# EAGLE design keypad (EAGLE 9.6.2)
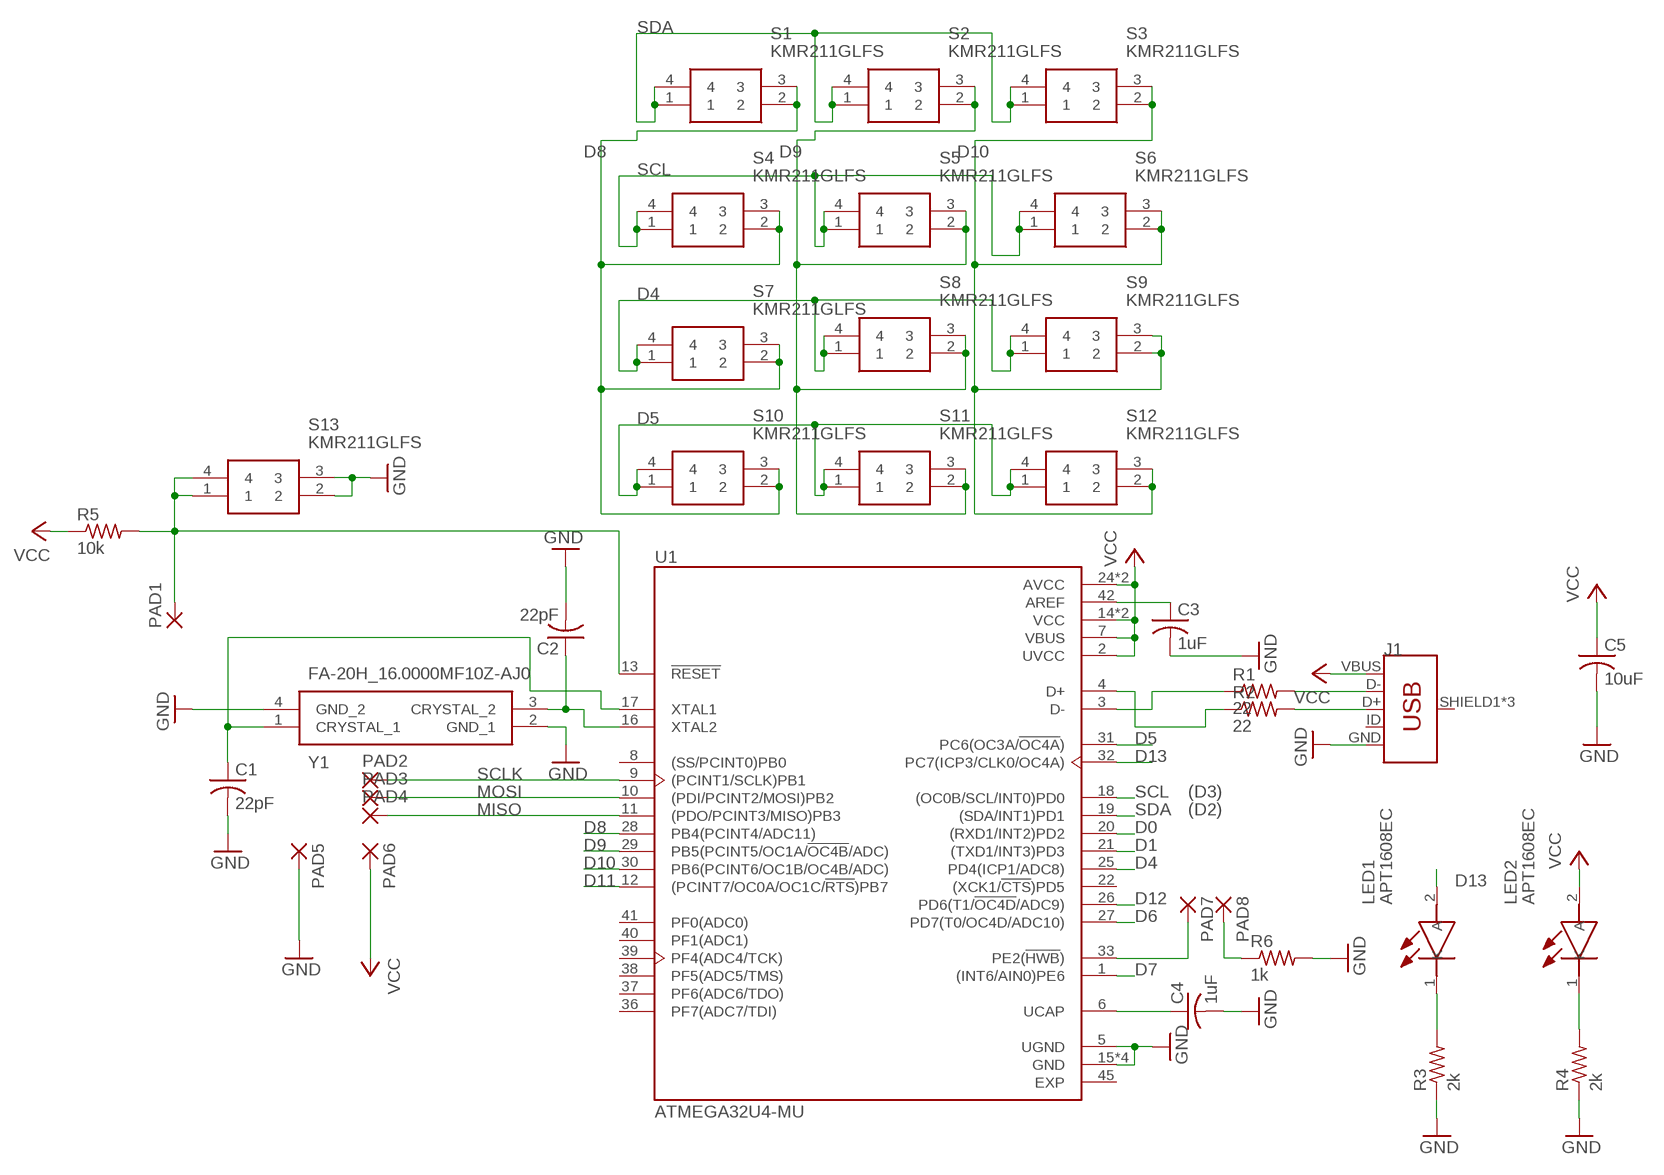
[diagram p0: schematic, sheet 1]

## Parts
C1  22pF  C-USC0603  [C0603]
C2  22pF  C-USC0603  [C0603]
C3  1uF  C-USC0603  [C0603]
C4  1uF  C-USC0603  [C0603]
C5  10uF  C-USC0603  [C0603]
J1  USB_MICRO-BREDUCED_PASTE  [USB-B-MICRO-SMD_RED_PASTE]
LED1  APT1608EC  [LEDC1608X85N]
LED2  APT1608EC  [LEDC1608X85N]
PAD1  SMD2  [SMD1,27-2,54]
PAD2  SMD2  [SMD1,27-2,54]
PAD3  SMD2  [SMD1,27-2,54]
PAD4  SMD2  [SMD1,27-2,54]
PAD5  SMD2  [SMD1,27-2,54]
PAD6  SMD2  [SMD1,27-2,54]
PAD7  SMD2  [SMD1,27-2,54]
PAD8  SMD2  [SMD1,27-2,54]
R1  22  R-US_R0603  [R0603]
R2  22  R-US_R0603  [R0603]
R3  2k  R-US_R0603  [R0603]
R4  2k  R-US_R0603  [R0603]
R5  10k  R-US_R0603  [R0603]
R6  1k  R-US_R0603  [R0603]
S1  KMR211GLFS  [KMR2_1]
S2  KMR211GLFS  [KMR2_1]
S3  KMR211GLFS  [KMR2_1]
S4  KMR211GLFS  [KMR2_1]
S5  KMR211GLFS  [KMR2_1]
S6  KMR211GLFS  [KMR2_1]
S7  KMR211GLFS  [KMR2_1]
S8  KMR211GLFS  [KMR2_1]
S9  KMR211GLFS  [KMR2_1]
S10  KMR211GLFS  [KMR2_1]
S11  KMR211GLFS  [KMR2_1]
S12  KMR211GLFS  [KMR2_1]
S13  KMR211GLFS  [KMR2_1]
U1  ATMEGA32U4-MU  [QFN50P700X700X100-45N]
Y1  FA-20H_16.0000MF10Z-AJ0  [FA20H160000MF12ZAC3]

## Nets
D0: U1.20((RXD1/INT2)PD2)
D1: U1.21((TXD1/INT3)PD3)
D4: S7.1 S7.4 S8.1 S8.4 S9.1 S9.4 U1.25(PD4(ICP1/ADC8))
D5: S10.1 S10.4 S11.1 S11.4 S12.1 S12.4 U1.31(PC6(OC3A/!OC4A!))
D6: U1.27(PD7(T0/OC4D/ADC10))
D7: U1.1((INT6/AIN0)PE6)
D8: S1.2 S1.3 S4.2 S4.3 S7.2 S7.3 S10.2 S10.3 U1.28(PB4(PCINT4/ADC11))
D9: S2.2 S2.3 S5.2 S5.3 S8.2 S8.3 S11.2 S11.3 U1.29(PB5(PCINT5/OC1A/!OC4B!/ADC))
D10: S3.2 S3.3 S6.2 S6.3 S9.2 S9.3 S12.2 S12.3 U1.30(PB6(PCINT6/OC1B/OC4B/ADC))
D11: U1.12((PCINT7/OC0A/OC1C/!RTS!)PB7)
D12: U1.26(PD6(T1/!OC4D!/ADC9))
D13: LED1.2(A) U1.32(PC7(ICP3/CLK0/OC4A))
GND: C1.2 C2.2 C3.2 C4.2 C5.2 J1.GND PAD5.1(P) R3.1 R4.1 R6.2 S13.2 S13.3 U1.5(UGND) U1.15(GND) U1.23(GND) U1.35(GND) U1.43(GND) Y1.2(GND_1) Y1.4(GND_2)
MISO: PAD4.1(P) U1.11((PDO/PCINT3/MISO)PB3)
MOSI: PAD3.1(P) U1.10((PDI/PCINT2/MOSI)PB2)
N$1: LED2.1(K) R4.2
N$2: PAD8.1(P) R6.1
N$3: PAD7.1(P) U1.33(PE2(!HWB!))
N$4: C2.1 U1.16(XTAL2) Y1.3(CRYSTAL_2)
N$7: C1.1 U1.17(XTAL1) Y1.1(CRYSTAL_1)
N$9: C3.1 U1.42(AREF)
N$10: C4.1 U1.6(UCAP)
N$12: J1.D- R1.2
N$13: J1.D+ R2.2
N$14: R1.1 U1.3(D-)
N$15: R2.1 U1.4(D+)
N$16: PAD1.1(P) R5.2 S13.1 S13.4 U1.13(!RESET!)
N$20: LED1.1(K) R3.2
SCL: S4.1 S4.4 S5.1 S5.4 S6.1 S6.4 U1.18((OC0B/SCL/INT0)PD0)
SCLK: PAD2.1(P) U1.9((PCINT1/SCLK)PB1)
SDA: S1.1 S1.4 S2.1 S2.4 S3.1 S3.4 U1.19((SDA/INT1)PD1)
VCC: C5.1 J1.VBUS LED2.2(A) PAD6.1(P) R5.1 U1.2(UVCC) U1.7(VBUS) U1.14(VCC) U1.24(AVCC) U1.34(VCC) U1.44(AVCC)
Unconnected: J1.ID J1.SHIELD1(SHIELD) J1.SHIELD2(SHIELD) J1.SHIELD3(SHIELD) U1.8((SS/PCINT0)PB0) U1.22((XCK1/!CTS!)PD5) U1.36(PF7(ADC7/TDI)) U1.37(PF6(ADC6/TDO)) U1.38(PF5(ADC5/TMS)) U1.39(PF4(ADC4/TCK)) U1.40(PF1(ADC1)) U1.41(PF0(ADC0)) U1.45(EXP)

## Notes on the sheet
- (D3)
- (D2)

## Library data of the parts
C1-C5 = adafruit:C-US: CAPACITOR, American symbol
J1 = SparkFun-Connectors:USB_MICRO-B: USB Type Micro-B Connector Male/female and PTH/SMT variants SparkFun Products: SparkFun microB USB Breakout <https://www.sparkfun.com/products/12035> SparkFun USB microB Plug Breakout <https://www.sparkfun.com/products/10031> SparkFun ESP8266 Thing <https://www.sparkfun.com/products/13231>; PROD_ID: CONN-11752
LED1 LED2 = APT1608EC:APT1608EC: Standard LEDs - SMD HI EFF RED WTR CLR Source: Datasheet <http://docs-emea.rs-online.com/webdocs/142e/0900766b8142ead4.pdf>; ARROW_PART_NUMBER: APT1608EC; ARROW_PRICE-STOCK: https://www.arrow.com/en/products/apt1608ec/kingbright; DESCRIPTION: Standard LEDs - SMD HI EFF RED WTR CLR; HEIGHT: 0.85mm; MANUFACTURER_NAME: Kingbright; MANUFACTURER_PART_NUMBER: APT1608EC; MOUSER_PART_NUMBER: 604-APT1608EC; MOUSER_PRICE-STOCK: https://www.mouser.co.uk/ProductDetail/Kingbright/APT1608EC?qs=y3UkhjaxUTbvcINjaB1ATQ%3D%3D
PAD1-PAD8 = wirepad:SMD2: SMD PAD
R1-R6 = adafruit:R-US_: RESISTOR, American symbol
S1-S13 = KMR211GLFS:KMR211GLFS: KMR211GLFS (Tactile Switches) Source: Datasheet <https://www.ckswitches.com/media/1479/kmr2.pdf>; DESCRIPTION: KMR211GLFS (Tactile Switches); HEIGHT: mm; MANUFACTURER_NAME: C & K COMPONENTS; MANUFACTURER_PART_NUMBER: KMR211GLFS; MOUSER_PART_NUMBER: 611-KMR211G-LFS; MOUSER_PRICE-STOCK: https://www.mouser.co.uk/ProductDetail/CK/KMR211GLFS?qs=sb%252But3Lm4x2P2O4tos22XA%3D%3D
U1 = ATMEGA32U4-MU:ATMEGA32U4-MU: 8-bit Microcontrollers - MCU AVR USB 32K FLASH INDUSTRIA Check prices <https://pricing.snapeda.com/search/part/ATMEGA32U4-MU/?ref=eda>; AVAILABILITY: Good; DESCRIPTION: AVR AVR® ATmega Microcontroller IC 8-Bit 16MHz 32KB (16K x 16) FLASH 44-VQFN (7x7); MF: Microchip Technology / Atmel; MP: ATMEGA32U4-MU; PACKAGE: VFQFN-44 Microchip Technology / Atmel; PRICE: None; PURCHASE-URL: https://pricing.snapeda.com/search/part/ATMEGA32U4-MU/?ref=eda
Y1 = FA-20H_16.0000MF10Z-AJ0:FA-20H_16.0000MF10Z-AJ0: Source: Datasheet <https://support.epson.biz/td/api/doc_check.php?dl=brief_FA-20H&lang=en>; ARROW_PART_NUMBER: FA-20H 16.0000MF10Z-AJ0; ARROW_PRICE-STOCK: https://www.arrow.com/en/products/fa-20h16.0000mf10z-aj0/epson-electronics-america; HEIGHT: 0.55mm; MANUFACTURER_NAME: Epson Timing; MANUFACTURER_PART_NUMBER: FA-20H 16.0000MF10Z-AJ0; MOUSER_PART_NUMBER: 732-FA-20H16MF10ZAJ0; MOUSER_PRICE-STOCK: https://www.mouser.co.uk/ProductDetail/Epson-Timing/FA-20H-160000MF10Z-AJ0?qs=f9yNj16SXrIaU%252BY5GFRuIg%3D%3D

## Board
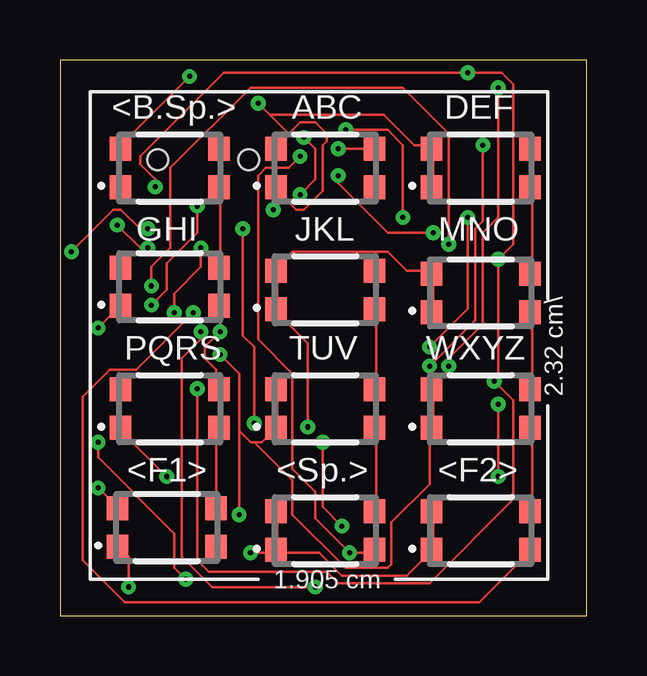
[diagram p1: board, top side]
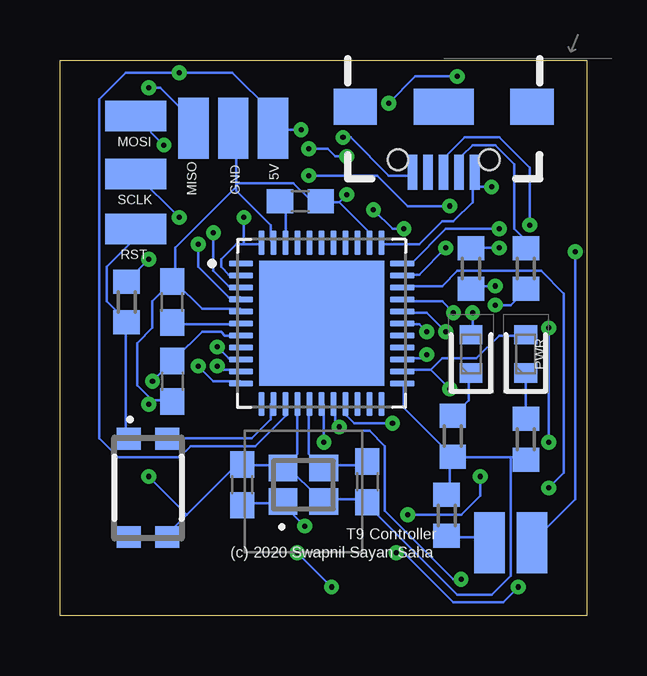
[diagram p2: board, bottom side, seen from below]

Size 21.95 x 23.16 mm. Coordinates in mm from the lower left corner, seen from the top.
Outline: 0,0 21.95,0 21.95,23.16 0,23.16 0,0
Copper layers (1*16): Top 0.035mm / dielectric 1.5mm / Bottom 0.035mm
Design rules "default *": minimum track width 4mil, minimum drill 0.21mm, track to track 5mil, track to pad 5mil, pad to pad 5mil, via to via 5mil, smd to smd 5mil, copper to edge 5mil, drill to drill 5mil, minimum pad ring 10mil, minimum via ring 8mil, stop-mask expansion 4mil, vias tented up to drill 20mil, thermal gap 10mil

### Footprints (pad centres in the part's own frame; a part is rotated, then mirrored left to right if it is on the bottom)
C0603 = smd 1.1 x 1: 1 -0.85,0; 2 0.85,0
USB-B-MICRO-SMD_RED_PASTE = smd 1.45 x 0.4: D+ 2.725,0; D- 2.725,0.65; GND 2.725,-1.3; ID 2.725,-0.65; VBUS 2.725,1.3 | smd 1.5 x 1.8: SHIELD1 0,3.685; SHIELD2 0,-3.685 | smd 1.5 x 2.5: SHIELD3 0,0 | hole 0.85: 2.2,1.9; 2.2,-1.9
LEDC1608X85N = smd 0.8 x 0.95: 1 -0.8,0; 2 0.8,0
SMD1,27-2,54 = smd 1.27 x 2.54: 1 0,0
R0603 = smd 1 x 1.1: 1 -0.85,0; 2 0.85,0
KMR2_1 = smd 0.9 x 1: 1 -2.05,-0.8; 2 2.05,-0.8; 3 2.05,0.8; 4 -2.05,0.8
QFN50P700X700X100-45N = smd 1.01 x 0.26: 1 -3.36,2.5; 2 -3.36,2; 3 -3.36,1.5; 4 -3.36,1; 5 -3.36,0.5; 6 -3.36,0; 7 -3.36,-0.5; 8 -3.36,-1; 9 -3.36,-1.5; 10 -3.36,-2; 11 -3.36,-2.5; 23 3.36,-2.5; 24 3.36,-2; 25 3.36,-1.5; 26 3.36,-1; 27 3.36,-0.5; 28 3.36,0; 29 3.36,0.5; 30 3.36,1; 31 3.36,1.5; 32 3.36,2; 33 3.36,2.5 | smd 0.26 x 1.01: 12 -2.5,-3.36; 13 -2,-3.36; 14 -1.5,-3.36; 15 -1,-3.36; 16 -0.5,-3.36; 17 0,-3.36; 18 0.5,-3.36; 19 1,-3.36; 20 1.5,-3.36; 21 2,-3.36; 22 2.5,-3.36; 34 2.5,3.36; 35 2,3.36; 36 1.5,3.36; 37 1,3.36; 38 0.5,3.36; 39 0,3.36; 40 -0.5,3.36; 41 -1,3.36; 42 -1.5,3.36; 43 -2,3.36; 44 -2.5,3.36 | smd 5.2 x 5.2: 45 0,0
FA20H160000MF12ZAC3 = smd 1.2 x 1.1: 1 -0.85,-0.7; 2 0.85,-0.7; 3 0.85,0.7; 4 -0.85,0.7

### Placement (x,y rotation side)
C1  14.35,5.46 90 bottom
C2  9.14,5.59 270 bottom
C3  11.94,17.27 0 bottom
C4  17.27,13.08 90 bottom
C5  17.27,9.78 270 bottom
J1  5.97,21.21 270 bottom
LED1  4.83,10.92 90 bottom
LED2  2.54,10.92 90 bottom
PAD1  18.8,16.13 90 bottom
PAD2  18.8,18.41 270 bottom
PAD3  18.8,20.83 270 bottom
PAD4  16.38,20.32 0 bottom
PAD5  14.73,20.32 0 bottom
PAD6  13.08,20.32 0 bottom
PAD7  2.29,3.05 0 bottom
PAD8  4.06,3.05 0 bottom
R1  2.54,14.48 90 bottom
R2  4.83,14.48 90 bottom
R3  5.59,7.49 90 bottom
R4  2.54,7.37 90 bottom
R5  19.18,13.08 270 bottom
R6  5.84,4.19 90 bottom
S1  4.57,18.67 0 top
S2  11.05,18.67 0 top
S3  17.53,18.67 0 top
S4  4.57,13.72 0 top
S5  11.05,13.59 0 top
S6  17.53,13.46 0 top
S7  4.57,8.64 0 top
S8  11.05,8.64 0 top
S9  17.53,8.64 0 top
S10  4.45,3.68 0 top
S11  11.05,3.56 0 top
S12  17.53,3.56 0 top
S13  18.29,5.33 270 bottom
U1  11.05,12.19 0 bottom
Y1  11.81,5.46 0 bottom

### Tracks (layer width: path | path; a pad name or v marks a point on that pad's centre or on a via)
D4  (via drill 0.21)
  Top 0.102: S9.4 15.56,9.3 15.56,7.87 S9.1 15.4,7.71 15.4,5.49 13.81,3.9 13.81,2.16 13.65,2 11.91,2 9.68,4.22 9.68,5.65 8.1,7.24 | S7.4 2.54,9.3 2.54,7.87 S7.1 2.54,7.71 v4.45,5.81 | S8.4 9.05,9.3 9.05,7.87 S8.1 8.89,7.71 8.41,7.24 8.1,7.24 | v6.67,10.89 7.46,10.1 7.46,7.71 | 7.46,7.71 7.94,7.24 8.1,7.24 | 7.46,7.71 v7.46,4.22
  Bottom 0.102: v6.67,10.89 6.83,10.73 7.62,10.73 U1.25 | v4.45,5.81 4.45,5.02 5.24,4.22 v7.46,4.22
D5  (via drill 0.21)
  Top 0.102: S11.1 9.05,2.79 9.05,4.22 S11.4 | S12.4 15.56,4.22 15.56,2.79 S12.1 15.4,2.63 14.45,1.68 11.75,1.68 10.79,2.63 9.05,2.63 S11.1 | v1.59,5.33 2.38,4.54 S10.4 2.38,4.38 2.38,2.95 S10.1 2.54,2.79 2.86,2.48 v2.86,1.21 | v7.94,2.63 8.89,2.63 S11.1
  Bottom 0.102: v1.59,5.33 0.95,5.97 0.95,13.43 1.91,14.38 5.4,14.38 6.03,13.75 7.62,13.75 U1.31 | v7.94,2.63 7.62,2.63 5.56,0.57 3.49,0.57 v2.86,1.21
D8  (via drill 0.21)
  Top 0.102: S10.2 6.51,2.95 6.51,4.38 S10.3 6.51,4.54 6.51,7.71 S7.2 6.67,7.87 6.67,9.3 S7.3 6.51,9.46 6.51,10.25 6.03,10.73 6.03,11.21 v6.67,11.84 6.67,12.8 S4.2 6.67,12.95 6.67,14.38 S4.3 6.67,14.54 6.67,17.72 S1.2 6.67,17.88 6.67,19.46 S1.3
  Bottom 0.102: v6.67,11.84 6.98,12.16 7.62,12.16 U1.28
D9  (via drill 0.21)
  Top 0.102: S5.3 13.18,14.38 13.18,12.8 S5.2 13.18,12.64 13.18,9.46 S8.3 13.18,9.3 13.18,7.87 S8.2 13.18,7.71 13.18,4.38 S11.3 13.18,4.22 13.18,2.79 S11.2 13.02,2.63 v12.06,2.63 10.64,4.06 10.64,5.17 9.68,6.13 9.68,10.1 8.26,11.52 8.26,18.35 8.57,18.67 9.53,18.67 v10,19.14 | S2.2 13.18,17.88 13.18,19.46 S2.3 13.02,19.46 v11.59,19.46 | v5.87,11.84 5.87,11.52 5.08,10.73 5.08,2.48 6.35,1.21 v10.64,1.21
  Bottom 0.102: v5.87,11.84 6.67,12.64 7.62,12.64 U1.29 | v12.06,2.63 v10.64,1.21 | v11.59,19.46 10.79,19.46 10.48,19.14 v10,19.14
D10  (via drill 0.21)
  Top 0.102: S3.3 19.68,19.46 19.68,17.88 S3.2 19.68,17.72 19.68,14.38 S6.3 19.68,14.22 19.68,12.8 S6.2 19.68,12.64 19.68,9.46 S9.3 19.68,9.3 19.68,7.87 S9.2 19.68,7.71 19.68,4.38 S12.3 19.68,4.22 19.68,2.79 S12.2 19.53,2.63 17.46,0.57 2.7,0.57 0.95,2.32 0.95,9.14 2.06,10.25 3.17,10.25 v5.56,12.64
  Bottom 0.102: v5.56,12.64 6.03,13.11 7.62,13.11 U1.30
D13  (via drill 0.21)
  Top 0.102: v4.76,12.64 4.76,13.43 5.87,14.54 v5.87,15.34
  Bottom 0.102: v4.76,12.64 4.76,11.84 LED1.2 | v5.87,15.34 6.98,14.22 7.62,14.22 U1.32
GND  (via drill 0.21)
  Top 0.102: v10.16,19.94 10.64,19.46 10.64,18.19 v10,17.56 | v18.26,5.81 v18.26,8.83
  Bottom 0.102: U1.5 14.45,12.8 16.03,12.8 17.14,13.91 C4.2 | 18.1,8.98 17.3,8.98 C5.2 | 18.1,8.98 18.73,9.62 18.73,11.37 18.1,12 18.1,13.11 17.3,13.91 C4.2 | 10.32,17.24 9.05,15.97 9.05,15.65 U1.35 | 10.32,17.24 10.95,17.24 C3.2 11.11,17.4 11.59,17.4 12.22,18.03 14.61,18.03 | v10.16,19.94 9.84,19.94 8.26,18.35 7.3,18.35 J1.GND | 10.32,17.24 v10,17.56 | 14.61,18.03 14.61,20.26 PAD5.1 | 14.61,18.03 14.61,17.88 | 14.61,17.88 14.61,17.72 13.18,16.29 13.18,15.65 U1.43 | 14.61,17.88 17.14,15.34 17.14,14.07 C4.2 | U1.23 7.62,9.62 7.62,8.67 5.71,6.76 R3.1 | R6.2 5.71,5.17 5.71,6.6 R3.1 | 3.17,6.6 5.56,6.6 R3.1 | 3.17,6.6 2.54,6.6 R4.1 | S13.2 19.05,3.27 17.62,3.27 S13.3 17.46,3.43 16.67,4.22 | 12.54,6.29 12.06,6.76 12.06,8.83 U1.15 | 16.67,4.22 14.45,6.45 C1.2 14.29,6.29 12.7,6.29 Y1.4 12.54,6.29 | 12.54,6.29 11.11,4.86 Y1.2 10.95,4.86 9.21,4.86 C2.2 9.21,4.7 5.4,0.89 3.97,0.89 3.17,1.68 3.17,6.6 | v18.26,8.83 18.1,8.98 | 16.67,4.22 v18.26,5.81
MISO  (via drill 0.21)
  Top 0.102: v16.19,10.41 16.19,10.73 17.62,12.16 17.62,15.97 18.26,16.61 v18.26,22
  Bottom 0.102: v16.19,10.41 15.56,9.78 14.45,9.78 U1.11 | v18.26,22 17.78,22 16.51,20.73 16.51,20.41 PAD4.1
MOSI  (via drill 0.21)
  Top 0.102: v15.4,10.41 17.3,12.32 17.3,16.13 17.62,16.45 v17.62,19.62
  Bottom 0.102: v15.4,10.41 15.24,10.25 14.45,10.25 U1.10 | v17.62,19.62 18.73,20.73 PAD3.1
N$1
  Bottom 0.102: R4.2 LED2.1
N$2
  Bottom 0.102: PAD8.1 4.29,3.27 5.71,3.27 R6.1
N$3  (via drill 0.21)
  Top 0.102: v3.65,16.13 3.33,16.13 2.54,16.92 2.22,16.92 v0.48,15.18
  Bottom 0.102: v3.65,16.13 5.87,16.13 7.3,14.7 7.62,14.7 U1.33 | v0.48,15.18 0.48,4.86 PAD7.1
N$4
  Bottom 0.102: U1.16 11.59,8.83 11.59,6.76 11.11,6.29 Y1.3 10.95,6.29 9.21,6.29 C2.1
N$7  (via drill 0.21)
  Top 0.102: v10.95,7.24 10.95,4.54 v11.75,3.75
  Bottom 0.102: v10.95,7.24 10.95,8.83 U1.17 | 12.7,4.7 v11.75,3.75 | 12.7,4.7 14.29,4.7 C1.1 | 12.7,4.7 Y1.1
N$9
  Bottom 0.102: U1.42 12.54,15.65 12.54,17.08 12.7,17.24 C3.1
N$10
  Bottom 0.102: U1.6 14.45,12.16 17.14,12.16 C4.1
N$12
  Bottom 0.102: R1.2 2.54,15.65 3.02,16.13 3.02,18.83 3.81,19.62 4.76,19.62 5.24,19.14 5.24,18.51 J1.D-
N$13  (via drill 0.21)
  Top 0.102: v3.65,15.34 3.33,15.34 v2.38,16.29
  Bottom 0.102: v3.65,15.34 4.76,15.34 R2.2 | v2.38,16.29 2.38,18.67 3.65,19.94 5.08,19.94 5.87,19.14 5.87,18.51 J1.D+
N$14  (via drill 0.21)
  Top 0.102: v15.56,15.97 13.65,15.97 11.59,18.03 v11.59,18.35 | v5.71,17.08 5.71,15.97 4.45,14.7 4.45,13.59 v3.81,12.95
  Bottom 0.102: v15.56,15.97 15.56,14.38 14.92,13.75 14.45,13.75 U1.3 | v11.59,18.35 8.73,18.35 7.46,17.08 v5.71,17.08 | v3.81,12.95 3.17,12.95 2.54,13.59 R1.1
N$15  (via drill 0.21)
  Top 0.102: v16.19,15.49 16.19,20.1 14.29,22 7.94,22 4.6,18.67 4.6,15.34 3.81,14.54 v3.81,13.75
  Bottom 0.102: v16.19,15.49 16.19,14.54 14.92,13.27 14.45,13.27 U1.4 | v3.81,13.75 4.76,13.75 R2.1
N$16
  Bottom 0.102: U1.13 13.18,8.83 13.18,8.19 13.97,7.4 17.46,7.4 S13.4 17.62,7.4 19.05,7.4 S13.1 19.21,7.4 19.21,12.16 R5.2 19.21,12.32 20,13.11 20,14.54 18.89,15.65 18.89,16.13 PAD1.1
N$20
  Bottom 0.102: LED1.1 4.92,10.1 4.92,8.98 5.56,8.35 R3.2
SCL  (via drill 0.21)
  Top 0.102: S6.1 15.56,12.8 15.56,14.22 S6.4 15.4,14.38 14.45,14.38 13.65,15.18 9.68,15.18 9.05,14.54 S5.4 9.05,14.38 9.05,12.8 S5.1 9.05,12.64 10.32,11.37 v10.32,7.87 | S4.4 2.54,14.38 2.54,12.95 S4.1 2.38,12.8 v1.59,12 | v1.59,7.24 1.59,6.6 4.76,3.43 4.76,2 v5.24,1.52
  Bottom 0.102: U1.18 10.48,8.83 10.48,8.03 v10.32,7.87 10.16,7.71 9.05,7.71 8.41,7.08 8.41,4.38 5.56,1.52 v5.24,1.52 | v1.59,7.24 v1.59,12
SCLK  (via drill 0.21)
  Top 0.102: v15.4,11.21 16.99,12.8 v16.99,16.61
  Bottom 0.102: v15.4,11.21 14.92,10.73 14.45,10.73 U1.9 | PAD2.1 v16.99,16.61
SDA  (via drill 0.21)
  Top 0.102: S3.1 15.56,17.88 15.56,19.46 S3.4 15.4,19.62 14.76,19.62 13.49,20.89 8.73,20.89 | S1.1 2.54,17.88 2.54,19.46 S1.4 2.54,19.62 v5.4,22.48 | 9.37,17.4 9.84,16.92 10.16,16.92 10.95,17.72 10.95,19.62 11.11,19.78 11.11,20.1 10.64,20.57 10,20.57 9.53,20.1 | 9.37,17.4 9.05,17.72 S2.1 9.37,17.4 | 9.53,20.1 9.05,19.62 S2.4 | v8.1,8.03 8.1,11.21 7.62,11.68 v7.62,16.13 | 9.37,17.4 v8.89,16.92 | 9.53,20.1 8.73,20.89 | 8.73,20.89 v8.26,21.37
  Bottom 0.102: v8.1,8.03 9.68,8.03 10,8.35 10,8.83 U1.19 | v7.62,16.13 8.1,16.13 v8.89,16.92 | v5.4,22.48 7.14,22.48 v8.26,21.37
VCC  (via drill 0.21)
  Top 0.102: v14.29,16.61 14.29,19.62 13.65,20.26 v11.91,20.26 | v5.71,9.46 5.71,2.32 6.19,1.84 11.11,1.84 11.59,1.36 15.4,1.36 18.89,4.86 18.89,8.98 v18.1,9.78 18.26,9.94 v18.26,14.86 18.89,15.49 18.89,22.16 18.41,22.64 v16.99,22.64 6.83,22.64 3.33,19.14 3.33,18.83 3.97,18.19 v3.97,17.88
  Bottom 0.102: 14.29,15.49 13.65,15.49 U1.44 | 14.29,15.49 14.61,15.49 15.24,14.86 15.24,14.54 14.92,14.22 14.45,14.22 U1.2 | U1.14 12.54,8.35 13.81,7.08 16.51,7.08 16.99,6.6 19.53,6.6 20.32,7.4 20.32,21.53 19.21,22.64 v16.99,22.64 14.76,22.64 13.18,21.05 13.18,20.41 PAD6.1 13.02,20.26 v11.91,20.26 | v14.29,16.61 14.29,15.49 | 4.76,17.88 4.76,18.35 J1.VBUS 4.76,17.88 | 4.76,17.88 4.76,17.24 5.56,16.45 6.03,16.45 6.98,15.49 8.57,15.49 U1.34 | 6.51,10.25 6.03,10.73 4.6,10.73 3.65,11.68 2.54,11.68 LED2.2 | 6.51,10.25 7.62,10.25 U1.24 | U1.7 14.45,11.68 15.08,11.68 15.24,11.84 16.03,11.84 17.14,10.73 C5.1 17.3,10.57 v18.1,9.78 | v18.26,14.86 19.05,14.07 R5.1 | v5.71,9.46 6.51,10.25 | v3.97,17.88 4.76,17.88

### Text on the board
tNames: <B.Sp.> | ABC | DEF | GHI | JKL | MNO | PQRS | TUV | WXYZ | 2.32 cm\ | <F1> | <Sp.> | <F2> | 1.905 cm
bNames: MOSI | 5V | GND | MISO | SCLK | RST | PWR | T9 Controller | (c) 2020 Swapnil Sayan Saha